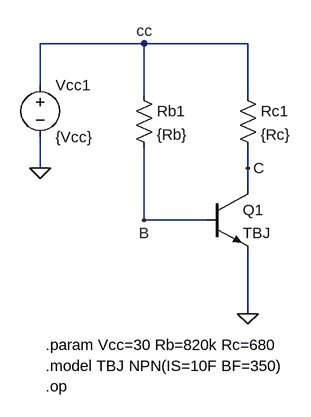
[diagram p0: schematic Draft2.asc]
Draft2.asc, the LTspice schematic file:
Version 4
SHEET 1 880 680
WIRE 64 -96 -96 -96
WIRE 224 -96 64 -96
WIRE -96 -32 -96 -96
WIRE 64 -16 64 -96
WIRE 224 -16 224 -96
WIRE -96 96 -96 48
WIRE 224 96 224 64
WIRE 224 128 224 96
WIRE 64 176 64 64
WIRE 160 176 64 176
WIRE 224 320 224 224
FLAG -96 96 0
FLAG 224 320 0
FLAG 64 -96 cc
FLAG 64 176 B
FLAG 224 96 C
SYMBOL res 48 -32 R0
SYMATTR InstName Rb1
SYMATTR Value {Rb}
SYMBOL res 208 -32 R0
SYMATTR InstName Rc1
SYMATTR Value {Rc}
SYMBOL voltage -96 -48 R0
WINDOW 123 0 0 Left 0
WINDOW 39 0 0 Left 0
SYMATTR InstName Vcc1
SYMATTR Value {Vcc}
SYMBOL npn 160 128 R0
SYMATTR InstName Q1
SYMATTR Value TBJ
TEXT -88 368 Left 2 !.param Vcc=30 Rb=820k Rc=680
TEXT -88 432 Left 2 !.op
TEXT -88 400 Left 2 !.model TBJ NPN(IS=10F BF=350)

The netlist it stands for:
* Draft2.asc
Rb1 cc B {Rb}
Rc1 cc C {Rc}
Vcc1 cc 0 {Vcc}
Q1 C B 0 0 TBJ
.model NPN NPN
.model PNP PNP
.lib standard.bjt
.param Vcc=30 Rb=820k Rc=680
.op
.model TBJ NPN(IS=10F BF=350)
.backanno
.end